# EAGLE design motor_module_pcb (EAGLE 6.4)
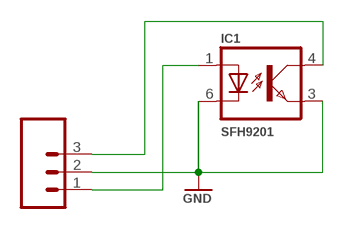
[diagram p0: schematic, sheet 1]

## Parts
IC1  SFH9201  LTV816SFH9201  [SMD6]
U$1  M03  [1X03-SMD]

## Nets
GND: IC1.3(EMIT) IC1.6(C) U$1.2
N$2: IC1.1(A) U$1.1
N$3: IC1.4(COL) U$1.3

## Library data of the parts
IC1 = dual_bldc_clock_hands:LTV816: OPTO COUPLER Source: LITEON, LTV816.pdf
U$1 = dual_bldc_clock_hands:M03

## Board
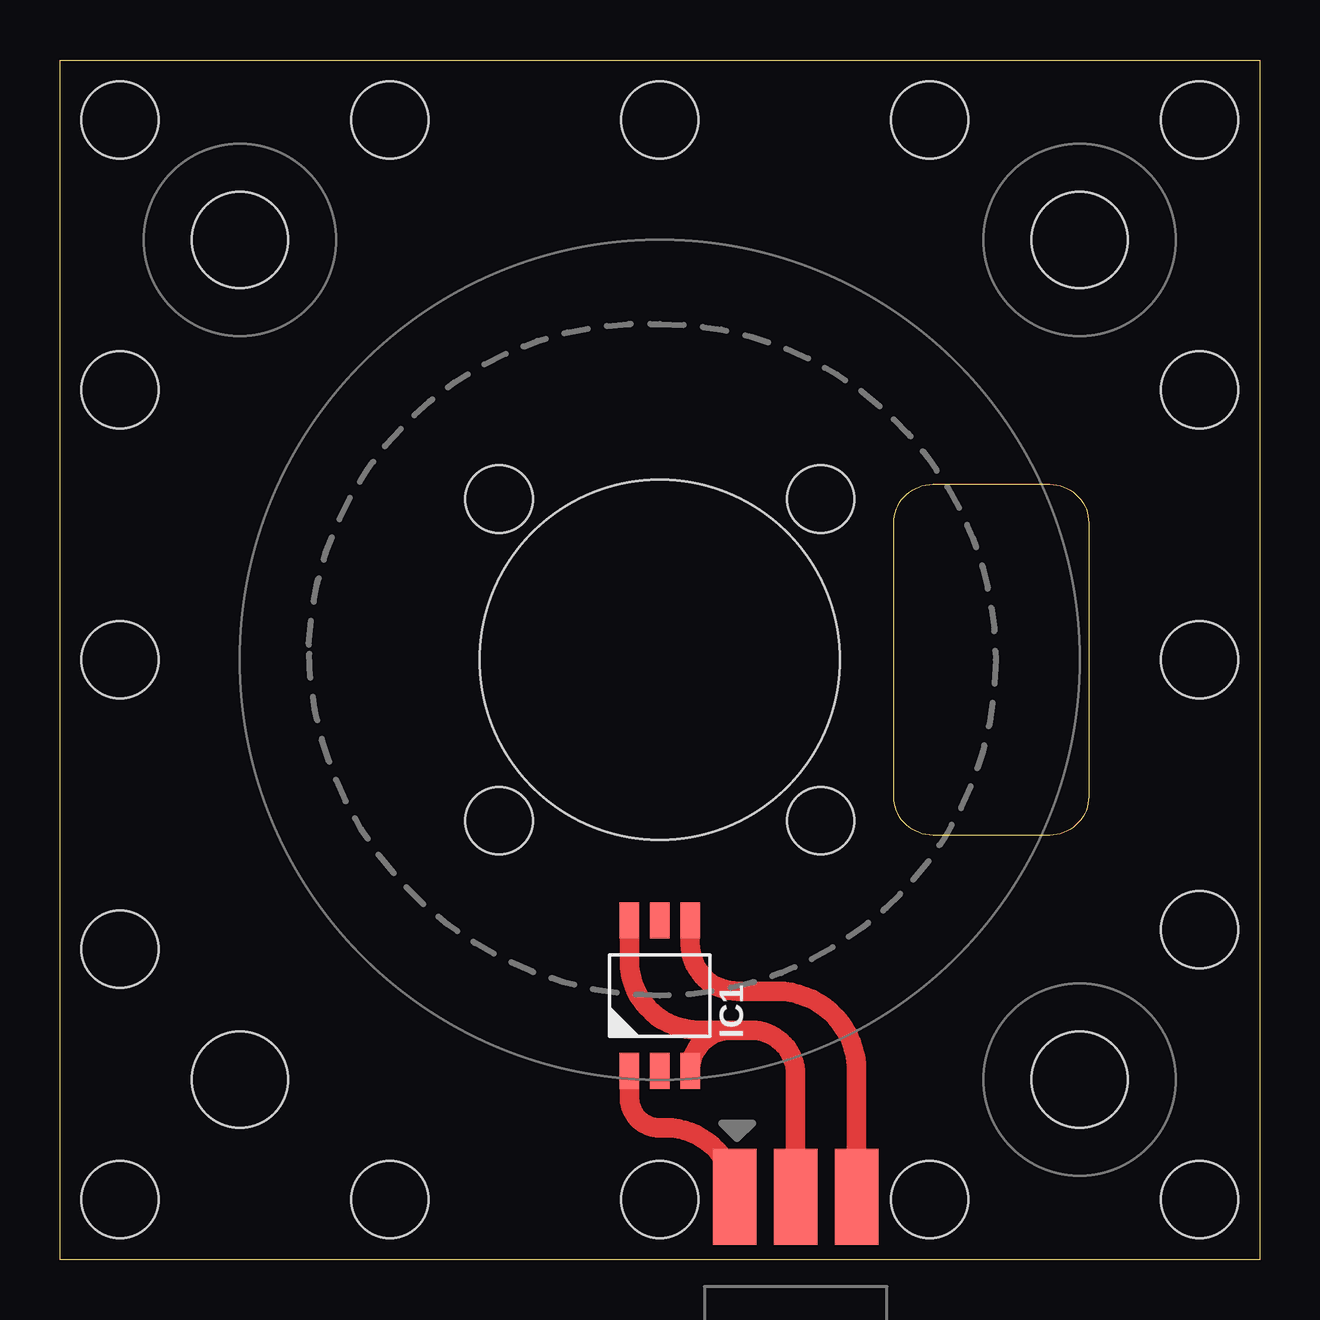
[diagram p1: board, top side]

Size 50 x 50 mm. Coordinates in mm from the lower left corner, seen from the top.
Outline: 0,50 50,50 50,0 0,0 0,50
Outline: 36.38,32.31 41.26,32.31 arc-90 42.88,30.69 42.88,19.31 arc-90 41.26,17.68 36.38,17.68 arc-90 34.75,19.31 34.75,30.69 arc-90 36.38,32.31
Copper layers (1*16): Top 0.035mm / dielectric 1.5mm / Bottom 0.035mm
Design rules "default": minimum track width 10mil, minimum drill 24mil, track to track 8mil, track to pad 8mil, pad to pad 8mil, via to via 8mil, smd to smd 8mil, copper to edge 40mil, drill to drill 8mil, minimum pad ring 10mil, minimum via ring 8mil, stop-mask expansion 4mil, vias tented up to drill 0mil, thermal gap 10mil
Holes 4 mm at 42.5,42.5 7.5,42.5 7.5,7.5 42.5,7.5
Holes 15 mm at 25,25
Holes 3.2 mm at 2.5,47.5 47.5,47.5 47.5,2.5 2.5,2.5 25,47.5 47.5,25 25,2.5 2.5,25 47.5,13.75 47.5,36.25 36.25,2.5 13.75,2.5 2.5,36.25 13.75,47.5 36.25,47.5 2.5,12.94
Holes 2.8 mm at 18.3,18.3 18.3,31.7 31.7,31.7 31.7,18.3

### Footprints (pad centres in the part's own frame; a part is rotated, then mirrored left to right if it is on the bottom)
SMD6 = smd 1.5 x 0.8: 1 -3.13,1.27; 2 -3.13,0; 3 -3.13,-1.27; 4 3.13,-1.27; 5 3.13,0; 6 3.13,1.27
1X03-SMD = smd 1.8 x 4: 1 -3.81,5; 2 -1.27,5; 3 1.27,5

### Placement (x,y rotation side)
IC1  25,11 90 top
U$1  31.94,-2.38 0 top

### Tracks (layer width: path | path; a pad name or v marks a point on that pad's centre or on a via)
GND
  Top 0.813: IC1.6 23.73,12.45 arc90 26.63,9.56 27.96,9.56 | 27.96,9.56 28.81,9.56 arc-90 30.67,7.7 U$1.2 | 27.96,9.56 arc90 IC1.3
N$2
  Top 0.813: IC1.1 23.73,6.76 arc90 25,5.49 25.25,5.49 arc-90 U$1.1 arc-90 28.25,2.87 28.25,3.87
N$3
  Top 0.813: IC1.4 26.27,13.16 arc90 28.25,11.18 29.88,11.18 arc-90 33.21,7.85 U$1.3

### Text on the board
bDocu: DUAL / CLOCK / HANDS / MOVEMENT | LED | GND | DET